# EasyEDA schematic schematic.json
TITLE: Sheet_1; REV: 1.0; Date: 2024-08-18; Sheet: 1/1; Drawn By: thetwoboom; Company: Your Company
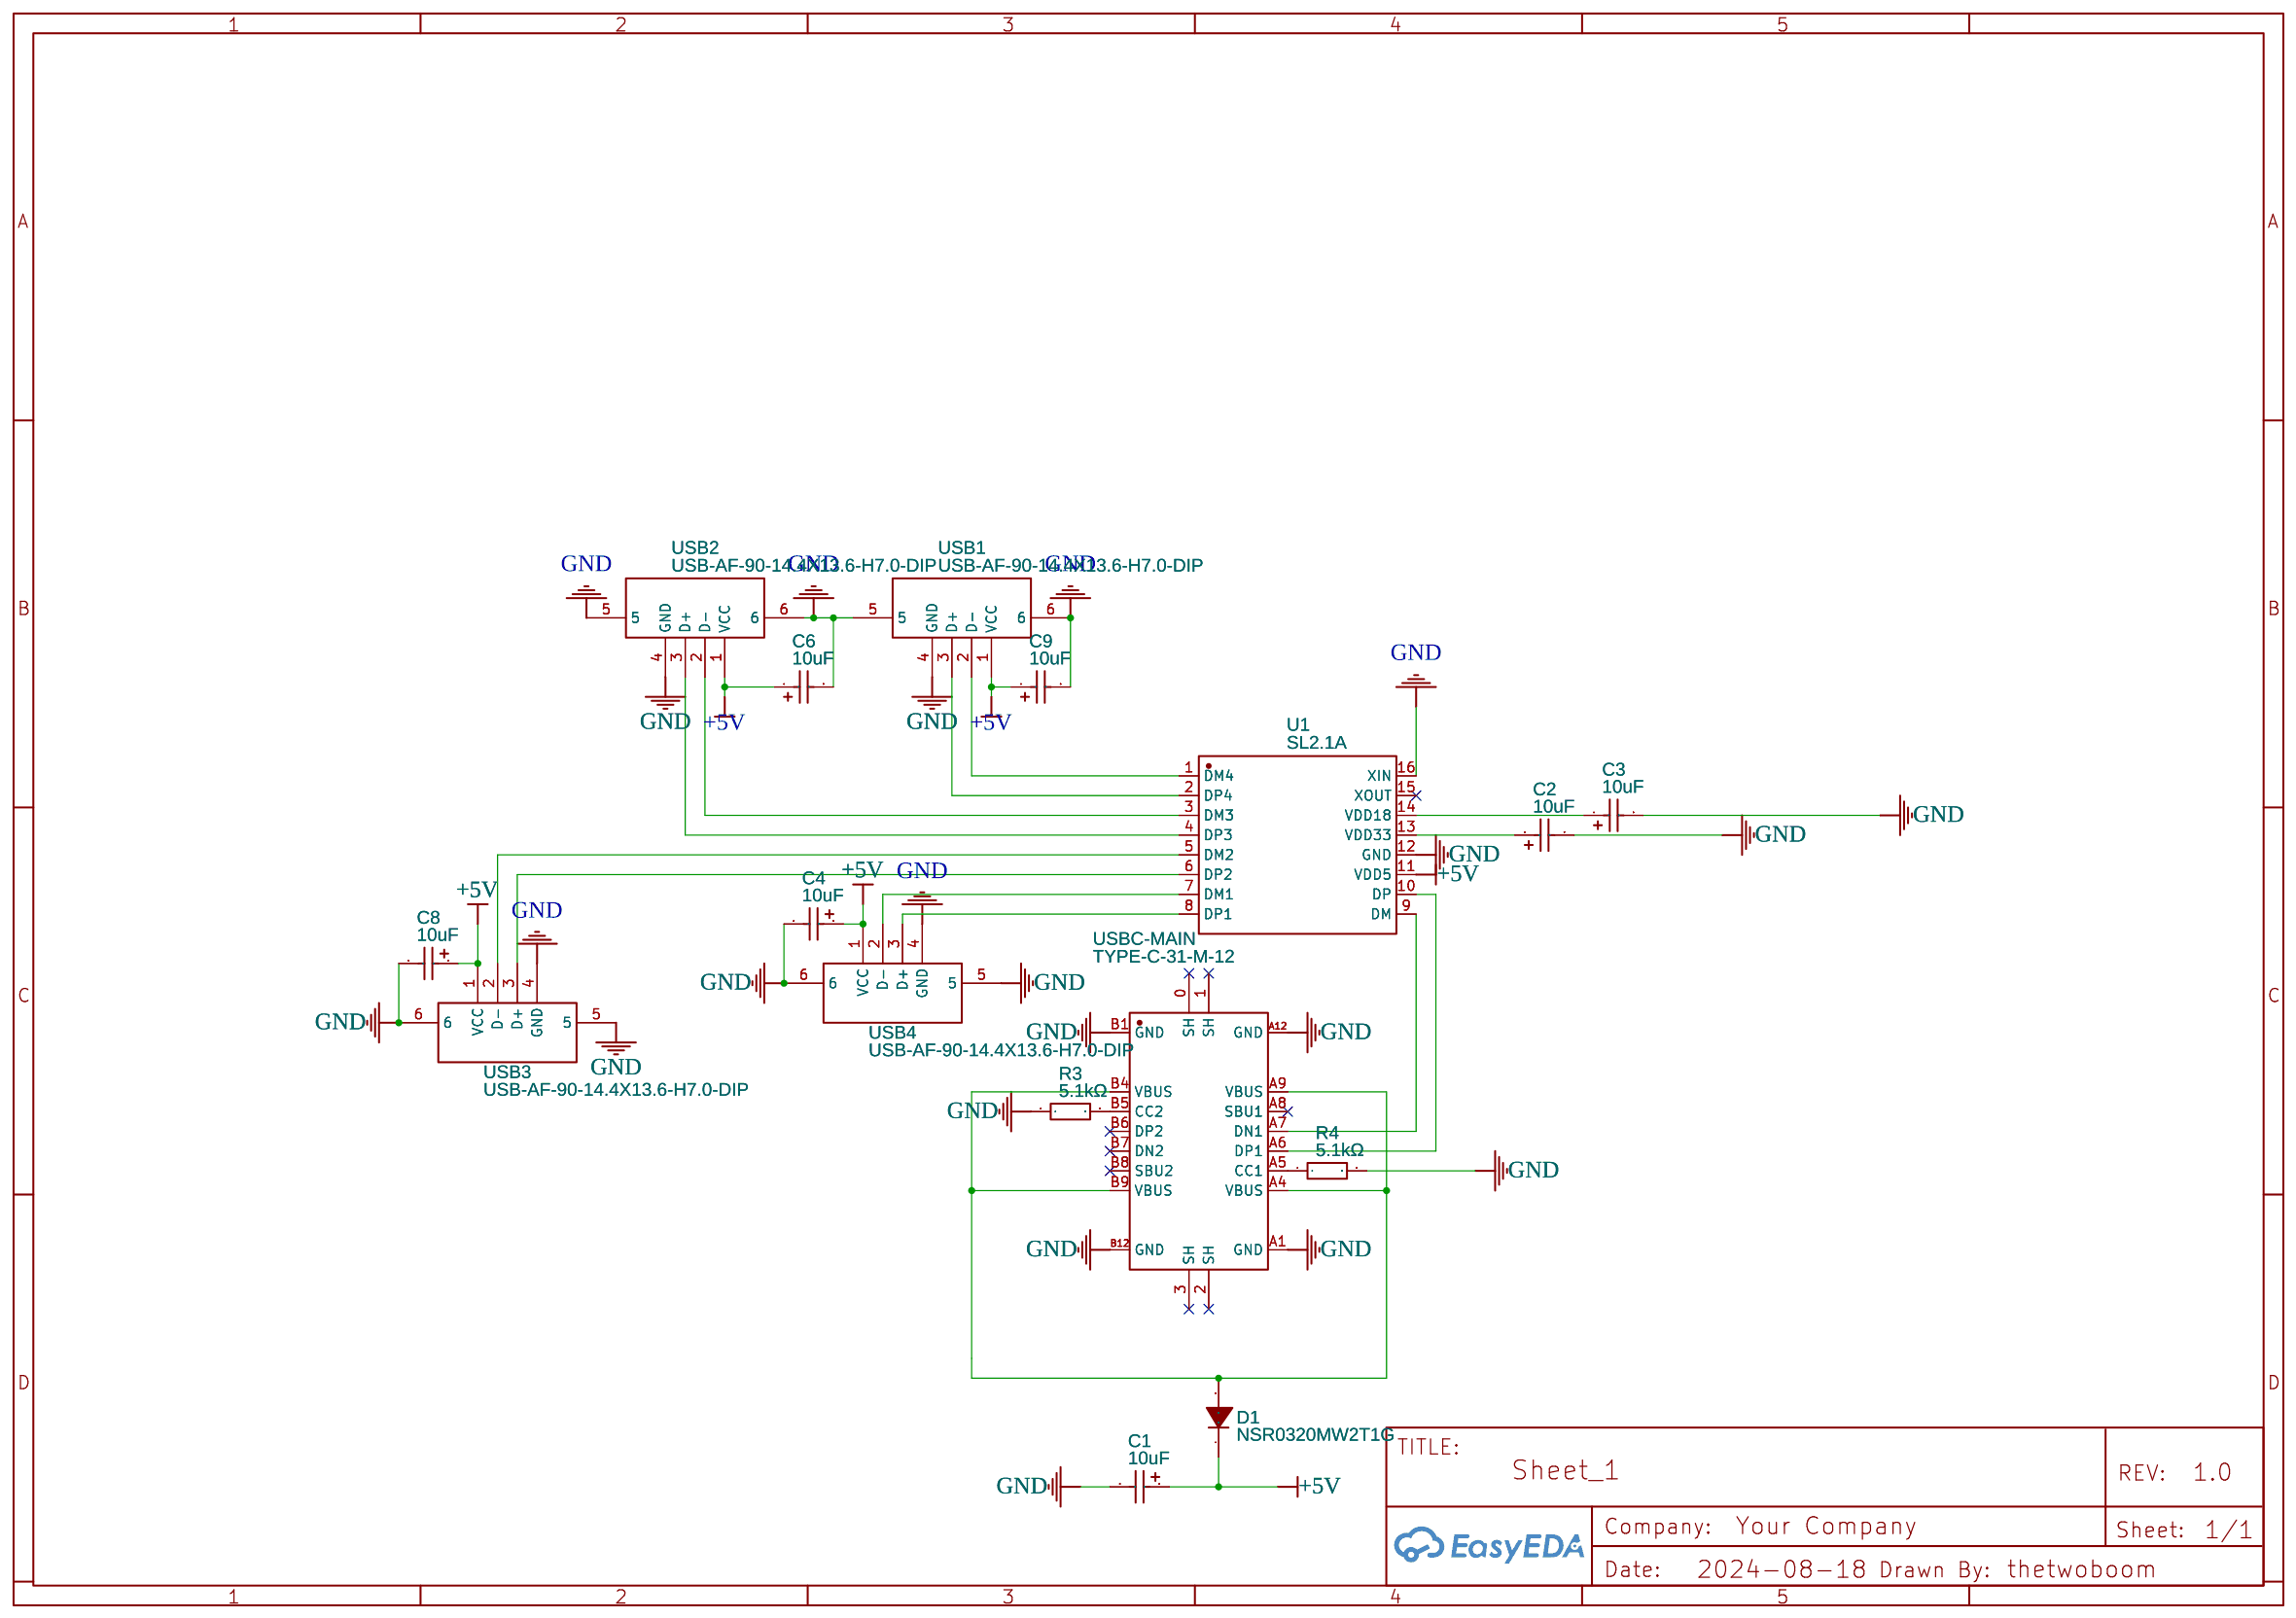
[diagram p0: schematic sheet]

## Parts
C1  10uF  [CAP-SMD_L3.2-W1.6-RD-C7171]
C2  10uF  [CAP-SMD_L3.2-W1.6-RD-C7171]
C3  10uF  [CAP-SMD_L3.2-W1.6-RD-C7171]
C4  10uF  [CAP-SMD_L3.2-W1.6-RD-C7171]
C6  10uF  [CAP-SMD_L3.2-W1.6-RD-C7171]
C8  10uF  [CAP-SMD_L3.2-W1.6-RD-C7171]
C9  10uF  [CAP-SMD_L3.2-W1.6-RD-C7171]
D1  NSR0320MW2T1G  [SOD-323_L1.8-W1.3-LS2.5-RD]
R3  5.1kΩ  [R0805]
R4  5.1kΩ  [R0805]
U1  SL2.1A  [SOP-16_L10.0-W3.9-P1.27-LS6.0-BL]
USB1  USB-AF-90-14.4X13.6-H7.0-DIP  [USB-A-TH_C46407]
USB2  USB-AF-90-14.4X13.6-H7.0-DIP  [USB-A-TH_C46407]
USB3  USB-AF-90-14.4X13.6-H7.0-DIP  [USB-A-TH_C46407]
USB4  USB-AF-90-14.4X13.6-H7.0-DIP  [USB-A-TH_C46407]
USBC-MAIN  TYPE-C-31-M-12  [USB-C_SMD-TYPE-C-31-M-12]

## Library data of the parts
C1-C4 C6 C8 C9 = TAJA106K016RNJ: Supplier: LCSC; Manufacturer: Kyocera AVX; Supplier Part: C7171; JLCPCB Part Class: Basic Part
D1 = NSR0320MW2T1G: Supplier: LCSC; Manufacturer: onsemi(安森美); Supplier Part: C48192; JLCPCB Part Class: Extended Part
R3 R4 = 0805W8F5101T5E: Supplier: LCSC; Manufacturer: UNI-ROYAL(厚声); Supplier Part: C27834; JLCPCB Part Class: Basic Part
U1 = SL2.1A: Contributor: LCSC; Supplier: LCSC; Supplier Part: C192893; Manufacturer: CoreChips(和芯润德); JLCPCB Part Class: Extended Part
USB1-USB4 = USB-AF-90-14.4X13.6-H7.0-DIP: Contributor: LCSC; Supplier: LCSC; Supplier Part: C46407; Manufacturer: 精拓金; Manufacturer Part: 903-131A1011D10100; JLCPCB Part Class: Extended Part
USBC-MAIN = TYPE-C-31-M-12: Contributor: LCSC; Supplier: LCSC; Supplier Part: C165948; Manufacturer: 韩国韩荣; JLCPCB Part Class: Extended Part

## Nets
+5V: C1.1 C4.1 C6.1 C8.1 C9.1 D1.1(C) U1.11(VDD5) USB1.1(VCC) USB2.1(VCC) USB3.1(VCC) USB4.1(VCC)
GND: C1.2 C2.2 C3.2 C4.2 C6.2 C8.2 C9.2 R3.1 R4.2 U1.12(GND) U1.16(XIN) USB1.4(GND) USB1.5 USB1.6 USB2.4(GND) USB2.5 USB2.6 USB3.4(GND) USB3.5 USB3.6 USB4.4(GND) USB4.5 USB4.6 USBC-MAIN.A1(GND) USBC-MAIN.A12(GND) USBC-MAIN.B1(GND) USBC-MAIN.B12(GND)
Net-(C2-1): C2.1 U1.13(VDD33)
Net-(C3-1): C3.1 U1.14(VDD18)
Net-(D1-2): D1.2(A) USBC-MAIN.A4(VBUS) USBC-MAIN.A9(VBUS) USBC-MAIN.B4(VBUS) USBC-MAIN.B9(VBUS)
Net-(R3-2): R3.2 USBC-MAIN.B5(CC2)
Net-(R4-1): R4.1 USBC-MAIN.A5(CC1)
Net-(U1-1): U1.1(DM4) USB1.2(D-)
Net-(U1-2): U1.2(DP4) USB1.3(D+)
Net-(U1-3): U1.3(DM3) USB2.2(D-)
Net-(U1-4): U1.4(DP3) USB2.3(D+)
Net-(U1-5): U1.5(DM2) USB3.2(D-)
Net-(U1-6): U1.6(DP2) USB3.3(D+)
Net-(U1-7): U1.7(DM1) USB4.2(D-)
Net-(U1-8): U1.8(DP1) USB4.3(D+)
Net-(U1-9): U1.9(DM) USBC-MAIN.A7(DN1)
Net-(U1-10): U1.10(DP) USBC-MAIN.A6(DP1)

Not connected (* = marked no-connect by the designer): U1 15(XOUT)*; USBC-MAIN 0(SH)* 1(SH)* 2(SH)* 3(SH)* A8(SBU1)* B6(DP2)* B7(DN2)* B8(SBU2)*
